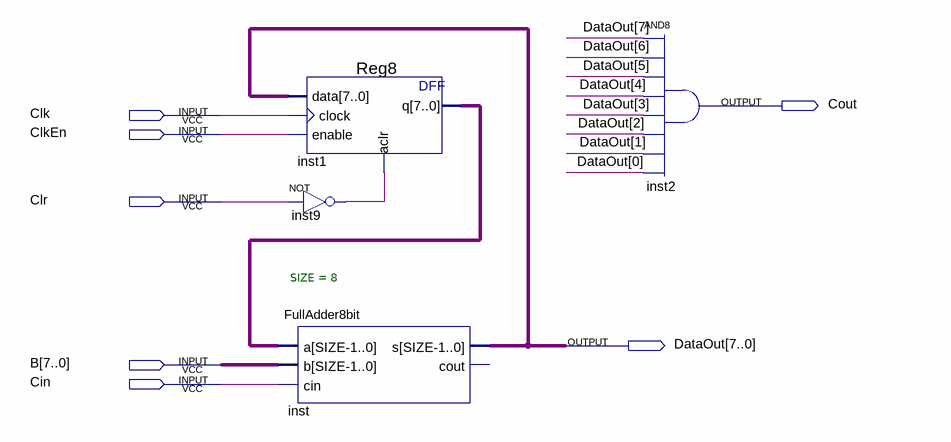
[diagram p0: schematic sheet]
// Quartus schematic BinaryCounter8bit.bdf as structural Verilog: 4 symbols, 7 pins
module BinaryCounter8bit (
  input  Clk,
  input  ClkEn,
  input  Clr,
  input  [7:0] B,
  input  Cin,
  output Cout,
  output [7:0] DataOut
);

  wire inst9_out;
  wire [7:0] inst1_q;

  Reg8 inst1 (.data(DataOut), .clock(Clk), .enable(ClkEn), .aclr(inst9_out), .q(inst1_q));
  not inst9 (inst9_out, Clr);
  FullAdder8bit #(.SIZE(8)) inst (.a(inst1_q), .b(B), .cin(Cin), .s(DataOut));  // open: cout
  and inst2 (Cout, DataOut[7], DataOut[6], DataOut[5], DataOut[4], DataOut[3], DataOut[2], DataOut[1], DataOut[0]);
endmodule
